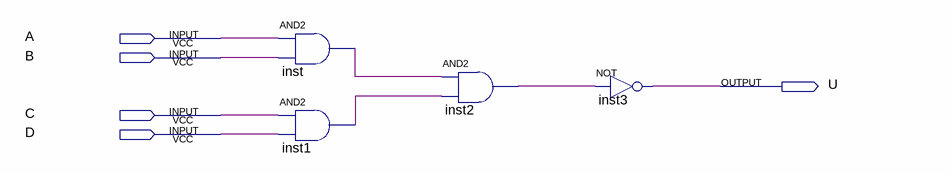
[diagram p0: schematic sheet]
// Quartus schematic Two-Chip-Logic-Circuit.bdf as structural Verilog: 4 symbols, 5 pins
module \Two-Chip-Logic-Circuit  (
  input  A,
  input  B,
  input  C,
  input  D,
  output U
);

  wire inst1_out, inst2_out, inst_out;

  and inst (inst_out, A, B);
  and inst1 (inst1_out, C, D);
  and inst2 (inst2_out, inst_out, inst1_out);
  not inst3 (U, inst2_out);
endmodule
